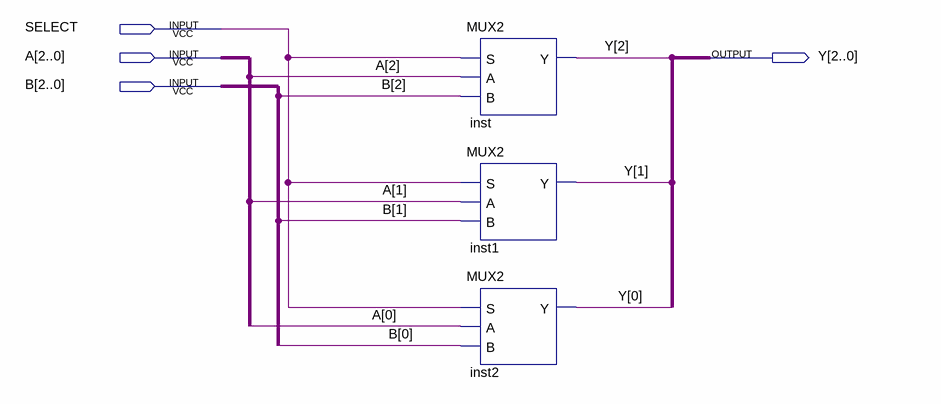
[diagram p0: schematic sheet]
// Quartus schematic mux2_3bit.bdf as structural Verilog: 3 symbols, 4 pins
module mux2_3bit (
  input  SELECT,
  input  [2:0] A,
  input  [2:0] B,
  output [2:0] Y
);

  MUX2 inst (.S(SELECT), .A(A[2]), .B(B[2]), .Y(Y[2]));
  MUX2 inst1 (.S(SELECT), .A(A[1]), .B(B[1]), .Y(Y[1]));
  MUX2 inst2 (.S(SELECT), .A(A[0]), .B(B[0]), .Y(Y[0]));
endmodule
